# EAGLE design Robberto (EAGLE 6.5.0)
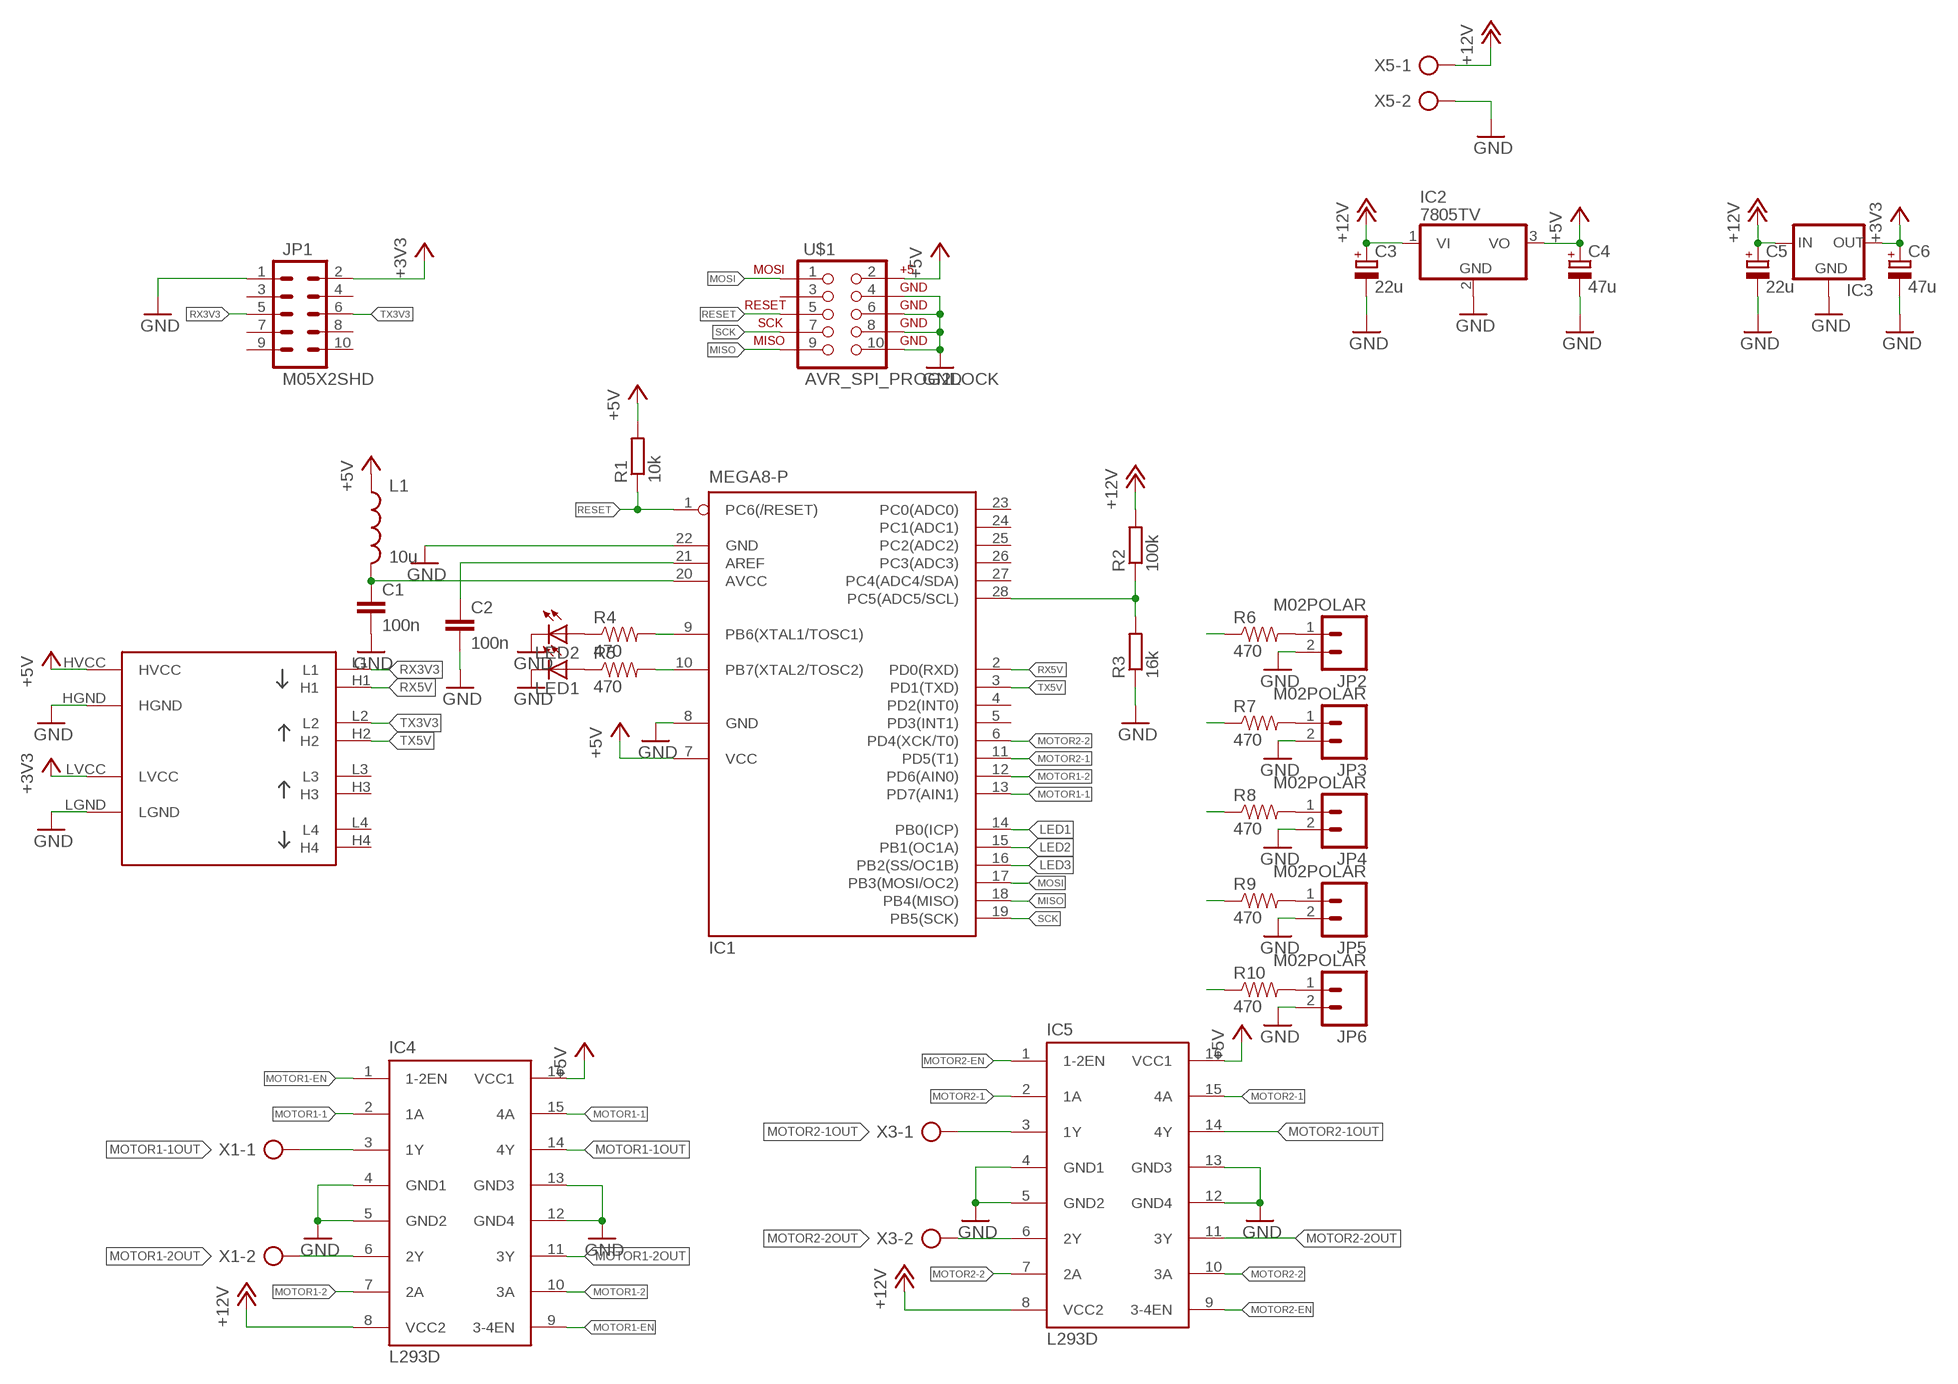
[diagram p0: schematic, sheet 1]

## Parts
C1  100n  C-EUC0805  [C0805]
C2  100n  C-EUC0805  [C0805]
C3  22u  CPOL-EUE2.5-7  [E2,5-7]
C4  47u  CPOL-EUE2.5-7  [E2,5-7]
C5  22u  CPOL-EUE2.5-7  [E2,5-7]
C6  47u  CPOL-EUE2.5-7  [E2,5-7]
IC1  MEGA8-P  [DIL28-3]
IC2  7805TV  [TO220V]
IC3  LFXXCVS  [TO220S]
IC4  L293D  [DIL16]
IC5  L293D  [DIL16]
JP1  M05X2SHD  [2X5-SHROUDED]
JP2  M02POLAR  [MOLEX-1X2]
JP3  M02POLAR  [MOLEX-1X2]
JP4  M02POLAR  [MOLEX-1X2]
JP5  M02POLAR  [MOLEX-1X2]
JP6  M02POLAR  [MOLEX-1X2]
L1  10u  INDUCTOR0805  [0805]
LED1  LEDSML0805  [SML0805]
LED2  LEDSML0805  [SML0805]
R1  10k  R-EU_M0805  [M0805]
R2  100k  R-EU_M0805  [M0805]
R3  16k  R-EU_M0805  [M0805]
R4  470  RESISTOR0805-RES  [0805]
R5  470  RESISTOR0805-RES  [0805]
R6  470  RESISTOR0805-RES  [0805]
R7  470  RESISTOR0805-RES  [0805]
R8  470  RESISTOR0805-RES  [0805]
R9  470  RESISTOR0805-RES  [0805]
R10  470  RESISTOR0805-RES  [0805]
U$1  AVR_SPI_PROG2LOCK  [2X5-SHROUDED_LOCK]
U$2  ELECTROPARK  [ELECTROPARK]
X1  AK300/2  [AK300/2]
X3  AK300/2  [AK300/2]
X5  AK300/2  [AK300/2]

## Nets
+3V3: C6.+ IC3.3(OUT) JP1.2 U$2.LVCC
+5V: C4.+ IC1.7(VCC) IC2.3(VO) IC4.16(VCC1) IC5.16(VCC1) L1.1 R1.2 U$1.2 U$2.HVCC
+12V: C3.+ C5.+ IC2.1(VI) IC3.1(IN) IC4.8(VCC2) IC5.8(VCC2) R2.2 X5.1
GND: C1.2 C2.2 C3.- C4.- C5.- C6.- IC1.8(GND) IC1.22(GND) IC2.2(GND) IC3.2(GND) IC4.4(GND1) IC4.5(GND2) IC4.12(GND4) IC4.13(GND3) IC5.4(GND1) IC5.5(GND2) IC5.12(GND4) IC5.13(GND3) JP1.1 JP2.2 JP3.2 JP4.2 JP5.2 JP6.2 LED1.C LED2.C R3.1 U$1.4 U$1.6 U$1.8 U$1.10 U$2.HGND U$2.LGND X5.2
LED1: IC1.14(PB0(ICP)) R6.1
LED2: IC1.15(PB1(OC1A)) R7.1
LED3: IC1.16(PB2(SS/OC1B)) R8.1
MISO: IC1.18(PB4(MISO)) R10.1 U$1.9
MOSI: IC1.17(PB3(MOSI/OC2)) R9.1 U$1.1
MOTOR1-1: IC1.13(PD7(AIN1)) IC4.2(1A) IC4.15(4A)
MOTOR1-1OUT: IC4.3(1Y) IC4.14(4Y) X1.1
MOTOR1-2: IC1.12(PD6(AIN0)) IC4.7(2A) IC4.10(3A)
MOTOR1-2OUT: IC4.6(2Y) IC4.11(3Y) X1.2
MOTOR1-EN: IC4.1(1-2EN) IC4.9(3-4EN)
MOTOR2-1: IC1.11(PD5(T1)) IC5.2(1A) IC5.15(4A)
MOTOR2-1OUT: IC5.3(1Y) IC5.14(4Y) X3.1
MOTOR2-2: IC1.6(PD4(XCK/T0)) IC5.7(2A) IC5.10(3A)
MOTOR2-2OUT: IC5.6(2Y) IC5.11(3Y) X3.2
MOTOR2-EN: IC5.1(1-2EN) IC5.9(3-4EN)
N$1: C1.1 IC1.20(AVCC) L1.2
N$2: C2.1 IC1.21(AREF)
N$3: IC1.28(PC5(ADC5/SCL)) R2.1 R3.2
N$4: LED2.A R4.1
N$5: LED1.A R5.1
N$6: IC1.10(PB7(XTAL2/TOSC2)) R5.2
N$7: IC1.9(PB6(XTAL1/TOSC1)) R4.2
N$8: JP2.1 R6.2
N$9: JP3.1 R7.2
N$10: JP4.1 R8.2
N$11: JP5.1 R9.2
N$12: JP6.1 R10.2
RESET: IC1.1(PC6(/RESET)) R1.1 U$1.5
RX3V3: JP1.5 U$2.L1
RX5V: IC1.2(PD0(RXD)) U$2.H1
SCK: IC1.19(PB5(SCK)) U$1.7
TX3V3: JP1.6 U$2.L2
TX5V: IC1.3(PD1(TXD)) U$2.H2
Unconnected: IC1.4(PD2(INT0)) IC1.5(PD3(INT1)) IC1.23(PC0(ADC0)) IC1.24(PC1(ADC1)) IC1.25(PC2(ADC2)) IC1.26(PC3(ADC3)) IC1.27(PC4(ADC4/SDA)) JP1.3 JP1.4 JP1.7 JP1.8 JP1.9 JP1.10 U$1.3 U$2.H3 U$2.H4 U$2.L3 U$2.L4

## Library data of the parts
C1 C2 = resistor:C-EU: CAPACITOR, European symbol
C3-C6 = resistor:CPOL-EU: POLARIZED CAPACITOR, European symbol
IC1 = atmel:MEGA8-P: MICROCONTROLLER 8 Kbytes FLASH, 1 kbytes SRAM, 512 bytes EEPROM, USART, 4-channel 10 bit ADC, 2-channel 8 bit ADC Pin compatible with Atmega48, ATMega88, ATMega168 Source: avr.lbr; OC_FARNELL: unknown; OC_NEWARK: unknown
IC2 = linear:78*: Positive VOLTAGE REGULATOR Source: http://cache.national.com/ds/LM/LM78L05.pdf http://www.fairchildsemi.com/ds/LM/LM7805.pdf
IC3 = lf33:LFXXCV: VOLTAGE REGULATOR
IC4 IC5 = st-microelectronics:L293D: PUSH-PULL 4 CHANNEL DRIVER; MPN: L293D; OC_FARNELL: 9589619; OC_NEWARK: 56P8249
JP1 = SparkFun-Connectors:M05X2: Header 5x2 Standard 10-pin dual row 0.1" header. Commonly used with AVR-ISP. Use with Spark Fun Electronics SKU: PRT-00778
JP2-JP6 = SparkFun-Connectors:M02: Standard 2-pin 0.1" header. Use with - straight break away headers ( PRT-00116) - right angle break away headers (PRT-00553) - swiss pins (PRT-00743) - machine pins (PRT-00117) - female headers (PRT-00115) Molex polarized connector foot print use with: PRT-08233 with associated crimp pins and housings. 2.54_SCREWTERM for use with PRT-10571. 3.5mm Screw Terminal footprints for PRT-08084 5mm Screw Terminal footprints for use with PRT-08433
L1 = SparkFun-Passives:INDUCTOR: Inductors Basic Inductor/Choke - 0603 and 1206. Footprints are not proven and vary greatly between part numbers. SRN6045- 33uH, 20% 1.4A SDR0403-560KL - 56uH, 10%, 500mA RMS/740mA peak
LED1 LED2 = led:LED: LED OSRAM: - CHIPLED LG R971, LG N971, LY N971, LG Q971, LY Q971, LO R971, LY R971 LH N974, LH R974 LS Q976, LO Q976, LY Q976 LO Q996 - Hyper CHIPLED LW Q18S LB Q993, LB Q99A, LB R99A - SideLED LS A670, LO A670, LY A670, LG A670, LP A670 LB A673, LV A673, LT A673, LW A673 LH A674 LY A675 LS A676, LA A676, LO A676, LY A676, LW A676 LS A679, LY A679, LG A679 - Hyper Micro SIDELED® LS Y876, LA Y876, LO Y876, LY Y876 LT Y87S - SmartLED LW L88C, LW L88S LB L89C, LB L89S, LG L890 LS L89K, LO L89K, LY L89K LS L896, LA L896, LO L896, LY L896 - TOPLED LS T670, LO T670, LY T670, LG T670, LP T670 LSG T670, LSP T670, LSY T670, LOP T670, LYG T670 LG T671, LOG T671, LSG T671 LB T673, LV T673, LT T673, LW T673 LH T674 LS T676, LA T676, LO T676, LY T676, LB T676, LH T676, LSB T676, LW T676 LB T67C, LV T67C, LT T67C, LS T67K, LO T67K, LY T67K, LW E67C LS E67B, LA E67B, LO E67B, LY E67B, LB E67C, LV E67C, LT E67C LW T67C LS T679, LY T679, LG T679 LS T770, LO T770, LY T770, LG T770, LP T770 LB T773, LV T773, LT T773, LW T773 LH T774 LS E675, LA E675, LY E675, LS T675 LS T776, LA T776, LO T776, LY T776, LB T776 LHGB T686 LT T68C, LB T68C - Hyper Mini TOPLED® LB M676 - Mini TOPLED Santana® LG M470 LS M47K, LO M47K, LY M47K Source: http://www.osram.convergy.de LUXEON: - LUMILED® LXK2-PW12-R00, LXK2-PW12-S00, LXK2-PW14-U00, LXK2-PW14-V00 LXK2-PM12-R00, LXK2-PM12-S00, LXK2-PM14-U00 LXK2-PE12-Q00, LXK2-PE12-R00, LXK2-PE12-S00, LXK2-PE14-T00, LXK2-PE14-U00 LXK2-PB12-K00, LXK2-PB12-L00, LXK2-PB12-M00, LXK2-PB14-N00, LXK2-PB14-P00, LXK2-PB14-Q00 LXK2-PR12-L00, LXK2-PR12-M00, LXK2-PR14-Q00, LXK2-PR14-R00 LXK2-PD12-Q00, LXK2-PD12-R00, LXK2-PD12-S00 LXK2-PH12-R00, LXK2-PH12-S00 LXK2-PL12-P00, LXK2-PL12-Q00, LXK2-PL12-R00 Source: www.luxeon.com KINGBRIGHT: KA-3528ASYC Source: www.kingbright.com
R1-R3 = resistor:R-EU_: RESISTOR, European symbol
R4-R10 = SparkFun-Resistors:RESISTOR: Resistor Basic schematic elements and footprints for 0603, 1206, and PTH resistors.
U$1 = SparkFun-Connectors:AVR_SPI_PROG2: AVR 10-pin ICSP Header This is the standard AVR In Circuit Serial Programming header. Minimal, but includes pin one indicator. Works with standard Olimex programmers. Also look for the 6-pin reduced version. Spark Fun Electronics SKU: PRT-00778
U$2 = konwerter_poziomow:ELECTROPARK: konwerter poziomów logicznych
X1 X3 X5 = con-ptr500:AK300/2: CONNECTOR; OC_FARNELL: unknown; OC_NEWARK: unknown

## Board
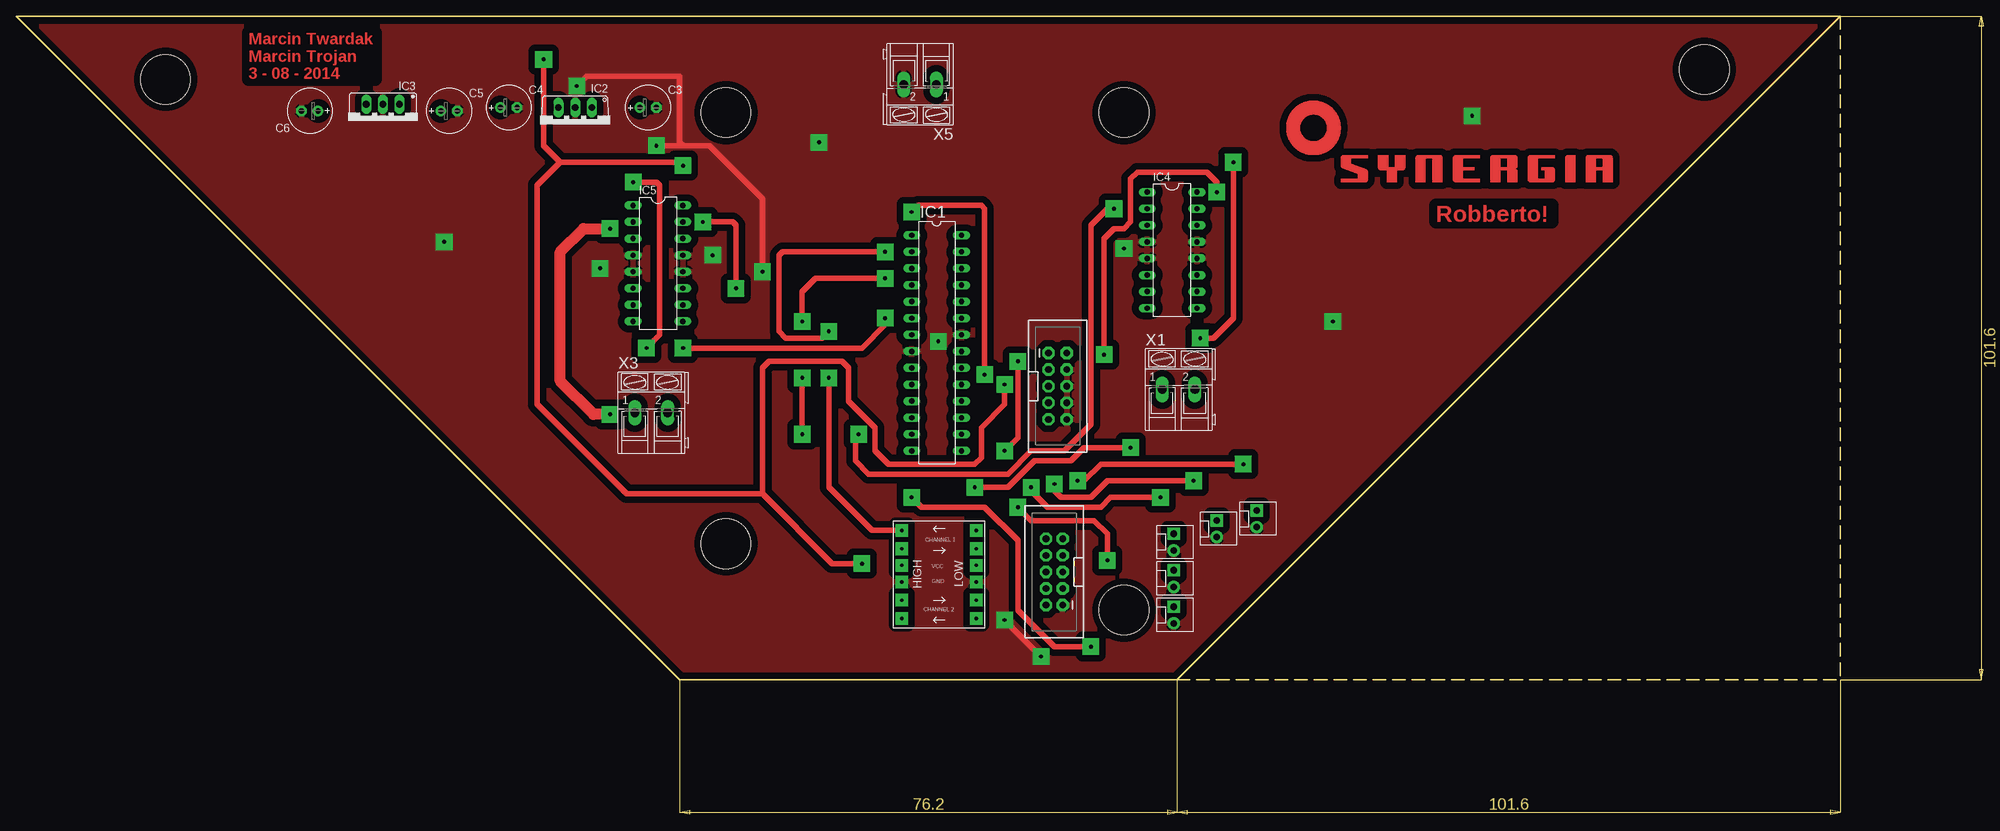
[diagram p1: board, top side]
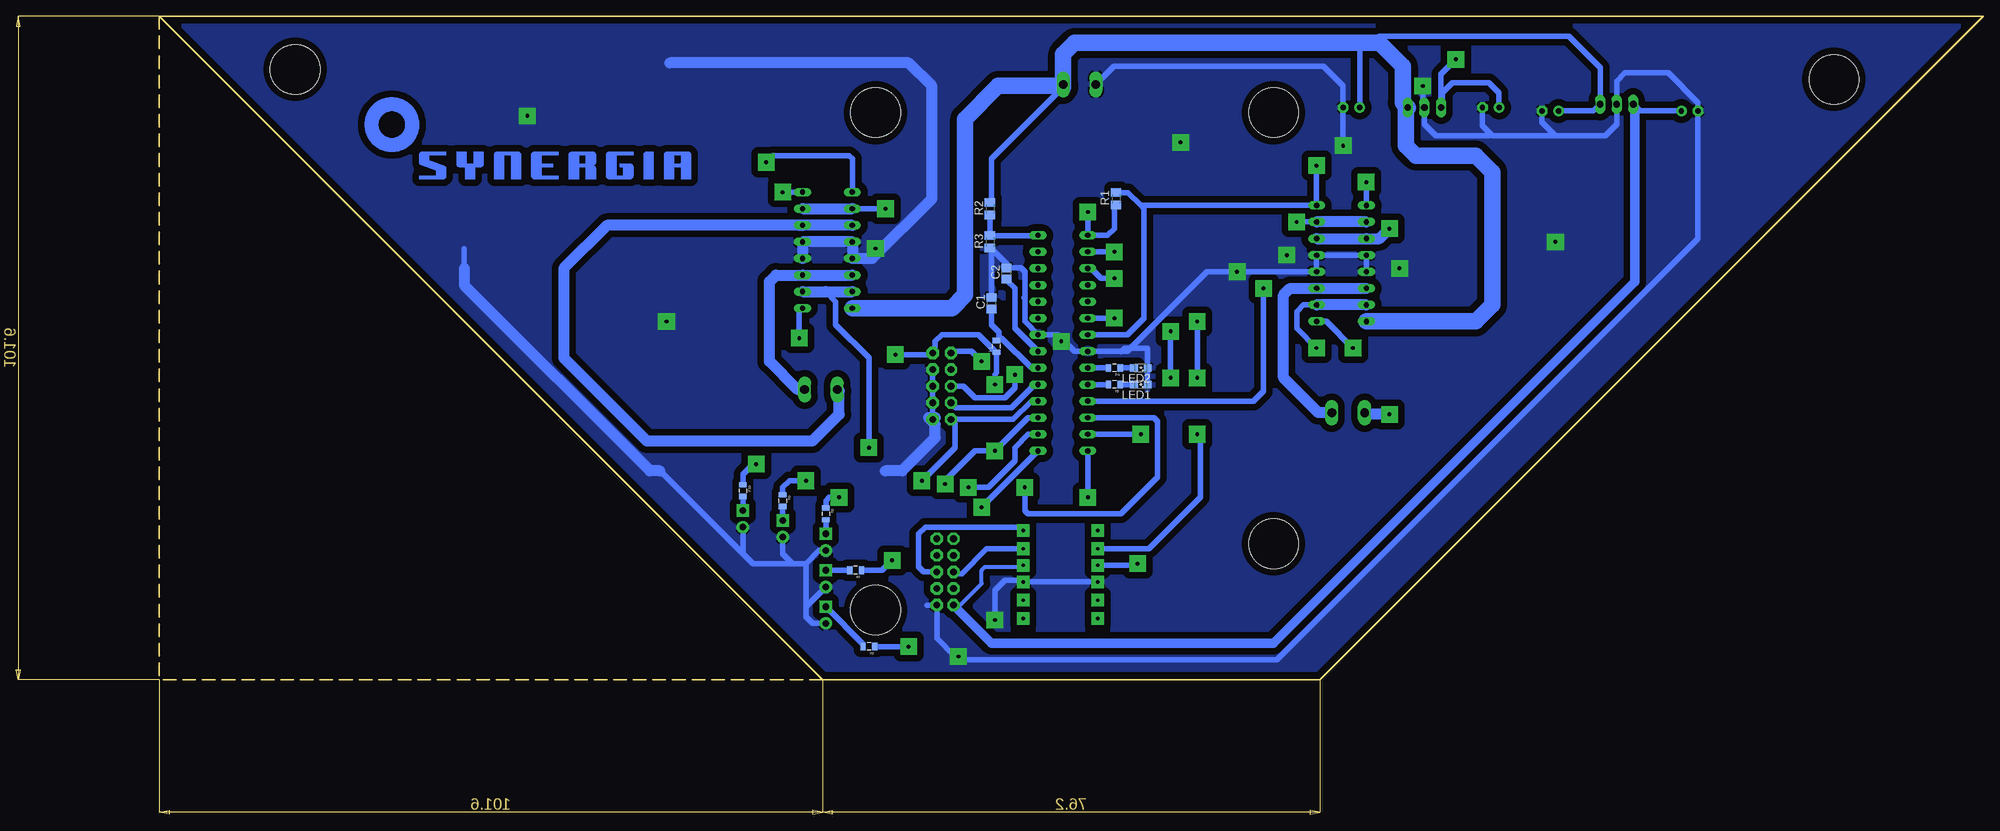
[diagram p2: board, bottom side, seen from below]

Size 279.4 x 101.6 mm. Coordinates in mm from the lower left corner, seen from the top.
Outline: 177.8,0 101.6,0 0,101.6 279.4,101.6
Outline: 177.8,0 279.4,101.6
Outline: 279.4,101.6 279.4,0 177.8,0
Copper layers (1*16): Top 0.035mm / dielectric 1.5mm / Bottom 0.035mm
Design rules "default *": minimum track width 10mil, minimum drill 2mil, track to track 8mil, track to pad 8mil, pad to pad 8mil, via to via 8mil, smd to smd 8mil, copper to edge 40mil, drill to drill 8mil, minimum pad ring 10mil, minimum via ring 8mil, stop-mask expansion 4mil, vias tented up to drill 0mil, thermal gap 10mil
Holes 7.62 mm at 169.67,10.67 108.71,20.83 169.67,86.87 108.71,86.87 258.57,93.47 22.86,91.95

### Footprints (pad centres in the part's own frame; a part is rotated, then mirrored left to right if it is on the bottom)
C0805 = smd 1.3 x 1.5: 1 -0.85,0; 2 0.85,0
E2,5-7 = drill 0.813 pad 1.6: + -1.27,0 | drill 0.813 pad 1.6 octagon: - 1.27,0
DIL28-3 = drill 0.813 long: 1 -16.51,-3.81; 2 -13.97,-3.81; 3 -11.43,-3.81; 4 -8.89,-3.81; 5 -6.35,-3.81; 6 -3.81,-3.81; 7 -1.27,-3.81; 8 1.27,-3.81; 9 3.81,-3.81; 10 6.35,-3.81; 11 8.89,-3.81; 12 11.43,-3.81; 13 13.97,-3.81; 14 16.51,-3.81; 15 16.51,3.81; 16 13.97,3.81; 17 11.43,3.81; 18 8.89,3.81; 19 6.35,3.81; 20 3.81,3.81; 21 1.27,3.81; 22 -1.27,3.81; 23 -3.81,3.81; 24 -6.35,3.81; 25 -8.89,3.81; 26 -11.43,3.81; 27 -13.97,3.81; 28 -16.51,3.81
TO220V = drill 1.016 long: 1 -2.54,-2.54; 2 0,-2.54; 3 2.54,-2.54
TO220S = drill 1.016 long: 1 -2.54,-2.54; 2 0,-2.54; 3 2.54,-2.54
DIL16 = drill 0.813 long: 1 -8.89,-3.81; 2 -6.35,-3.81; 3 -3.81,-3.81; 4 -1.27,-3.81; 5 1.27,-3.81; 6 3.81,-3.81; 7 6.35,-3.81; 8 8.89,-3.81; 9 8.89,3.81; 10 6.35,3.81; 11 3.81,3.81; 12 1.27,3.81; 13 -1.27,3.81; 14 -3.81,3.81; 15 -6.35,3.81; 16 -8.89,3.81
2X5-SHROUDED = drill 1.016 pad 1.88 octagon: 1 -1.27,5.08; 2 1.27,5.08; 3 -1.27,2.54; 4 1.27,2.54; 5 -1.27,0; 6 1.27,0; 7 -1.27,-2.54; 8 1.27,-2.54; 9 -1.27,-5.08; 10 1.27,-5.08
MOLEX-1X2 = drill 1.016 pad 1.88 square: 1 0,0 | drill 1.016 pad 1.88: 2 2.54,0
0805 = smd 0.8 x 1.2: 1 -0.9,0; 2 0.9,0
SML0805 = smd 1.2 x 1.2: A 1.05,0; C -1.05,0
M0805 = smd 1.3 x 1.6: 1 -0.95,0; 2 0.95,0
2X5-SHROUDED_LOCK = drill 1.016 pad 1.88 octagon: 1 -1.397,5.08; 2 1.397,5.08; 3 -1.397,2.54; 4 1.397,2.54; 5 -1.397,0; 6 1.397,0; 7 -1.397,-2.54; 8 1.397,-2.54; 9 -1.397,-5.08; 10 1.397,-5.08
ELECTROPARK = drill 0.5 pad 1.93 square: H1 1.27,-1.524; H2 1.27,-4.318; H3 1.27,-12.192; H4 1.27,-14.986; HGND 1.27,-9.398; HVCC 1.27,-6.858; L1 12.7,-1.524; L2 12.7,-4.318; L3 12.7,-12.192; L4 12.7,-14.986; LGND 12.7,-9.398; LVCC 12.7,-6.858
AK300/2 = drill 1.321 long: 1 -2.515,0; 2 2.489,0

### Placement (x,y rotation side)
C1  151.89,57.66 90 bottom
C2  149.61,62.23 90 bottom
C3  96.77,87.63 0 top
C4  75.44,87.63 0 top
C5  66.29,87.12 0 top
C6  44.96,87.12 180 top
IC1  140.97,51.56 270 top
IC2  85.6,85.09 180 top
IC3  56.13,85.6 180 top
IC4  177.04,65.79 270 top
IC5  98.3,63.75 270 top
JP1  159,16.51 180 top
JP2  177.29,11.18 270 top
JP3  177.29,16.76 270 top
JP4  177.29,22.35 270 top
JP5  183.9,24.38 270 top
JP6  189.99,25.91 270 top
L1  151.13,51.05 90 bottom
LED1  129.03,45.21 180 bottom
LED2  129.03,47.75 180 bottom
R1  132.84,73.66 90 bottom
R2  152.15,72.14 90 bottom
R3  152.15,67.06 90 bottom
R4  133.1,47.75 180 bottom
R5  133.1,45.21 180 bottom
R6  170.69,5.08 180 bottom
R7  172.72,16.76 180 bottom
R8  177.29,25.4 270 bottom
R9  183.9,27.43 270 bottom
R10  189.99,28.96 270 bottom
U$1  159.51,44.96 0 top
U$2  134.37,24.38 0 top
U$3  [SYNERGIA_50MM]  194.56,76.2 0 top
U$4  [SYNERGIA_50MM]  247.9,76.71 0 bottom
X1  178.05,44.45 0 top
X3  97.28,40.89 0 top
X5  138.43,91.19 180 top

### Tracks (layer width: path | path; a pad name or v marks a point on that pad's centre or on a via)
+3V3
  Bottom 0.61: JP1.2 156.72,11.43 153.42,14.73 153.42,16.76 152.91,17.27 147.32,17.27 U$2.LVCC
  Bottom 0.813: C6.+ 52.58,87.12 IC3.3
  Bottom 1.422: IC3.3 53.59,87.63 53.34,87.38 53.34,60.96 108.71,5.59 151.89,5.59 JP1.2
+5V  (via drill 0.6 pad 2.54)
  Top 0.813: v80.77,95 80.77,81.79 83.31,79.25 | 83.31,79.25 101.6,79.25 v102.11,78.74 | v129.54,17.78 124.97,17.78 114.3,28.45 | 114.3,28.45 93.47,28.45 79.76,42.16 79.76,75.69 83.31,79.25 | v151.38,45.21 151.38,42.16 147.83,38.61 147.83,34.04 146.81,33.02 133.6,33.02 131.57,35.05 131.57,38.61 127.51,42.67 127.51,47.75 126.49,48.77 115.32,48.77 114.3,47.75 114.3,28.45 | v183.9,74.68 183.9,76.2 182.37,77.72 171.7,77.72 170.69,76.71 170.69,70.1 169.67,69.09 168.15,69.09 166.62,67.56 v166.62,49.78
  Bottom 0.813: IC1.7 131.06,52.83 128.52,55.37 128.52,72.14 129.03,72.64 | IC5.16 102.62,72.64 | 102.62,72.64 129.03,72.64 | C4.+ 74.17,89.92 75.69,91.44 81.28,91.44 82.8,89.92 82.8,87.88 IC2.3 83.06,92.71 v80.77,95 | v102.11,78.74 102.11,73.15 102.62,72.64 | IC4.16 v183.9,74.68 | v166.62,49.78 161.16,49.78 U$1.2 160.53,50.42 160.53,51.82 159.51,52.83 153.92,52.83 151.25,50.15 L1.1 151.13,46.99 151.38,46.74 v151.38,45.21 | U$2.HVCC 129.79,17.53 v129.54,17.78 | R1.2 131,74.61 129.03,72.64
+12V
  Bottom 0.813: X5.1 140.94,90.7 151.89,79.76 151.89,73.34 R2.2 | C3.+ 95.5,97.03 95,97.54 | C5.+ 59.69,87.12 IC3.1 58.67,93.73 63.5,98.55 92.46,98.55 93.47,97.54
  Bottom 1.778: 88.39,87.88 IC2.1
  Bottom 2.54: IC4.8 157.99,56.9 155.96,58.93 155.96,85.85 150.88,90.93 141.2,90.93 X5.1 | 140.94,90.7 140.94,95.78 139.19,97.54 95,97.54 93.47,97.54 92.46,97.54 88.9,93.98 88.9,88.39 IC2.1 88.39,87.38 88.39,81.79 86.87,80.26 77.72,80.26 75.18,77.72 75.18,57.4 77.72,54.86 IC5.8
GND  (via drill 0.6 pad 2.54)
  Top 0.813: v85.85,90.93 87.38,92.46 101.6,92.46 101.6,82.3 102.11,81.79 | v156.97,3.56 v151.38,9.14 | v98.04,81.79 102.11,81.79 | 102.11,81.79 106.17,81.79 114.3,73.66 v114.3,62.48
  Bottom 0.813: U$1.4 U$1.6 U$1.8 U$1.10 | IC5.5 IC5.4 IC5.13 IC5.12 v114.3,62.48 118.87,62.48 131.06,50.29 132.08,50.29 | 132.08,50.29 IC1.8 139.19,50.29 141.73,52.83 IC1.22 146.81,54.86 146.81,58.42 | 65.53,83.31 57.91,83.31 56.13,85.09 IC3.2 56.13,91.69 54.86,92.96 48.26,92.96 43.69,88.39 C6.- 43.69,67.56 108.2,3.05 156.46,3.05 v156.97,3.56 157.48,3.56 160.27,6.35 JP1.1 161.8,11.43 | 65.53,83.31 67.56,85.34 C5.- | C4.- 76.71,84.84 75.44,83.57 | 75.44,83.57 75.18,83.31 65.53,83.31 | v98.04,81.79 C3.- 98.04,90.93 101.09,93.98 133.15,93.98 X5.2 | v85.85,90.93 85.85,87.88 IC2.2 85.6,85.09 83.82,83.31 75.69,83.31 75.44,83.57 | U$2.HGND U$2.LGND 147.32,15.24 149.86,15.24 151.38,13.72 v151.38,9.14 | 146.81,58.42 146.81,62.48 147.41,63.08 C2.2 149.35,63.33 149.35,63.5 151.96,66.11 R3.1 151.89,65.85 C1.2 | 146.9,58.51 146.81,58.42 | LED1.C LED2.C 127.98,48.23 128.02,48.26 128.02,50.8 131.57,50.8 132.08,50.29 | 132.05,50.26 132.08,50.29 | JP2.2 179.32,8.64 180.34,9.65 180.34,11.18 | 180.34,11.18 JP3.2 | JP4.2 178.31,19.81 180.34,17.78 | 180.34,17.78 180.34,11.18 | 180.34,17.78 182.37,17.78 | 182.37,17.78 183.9,19.3 JP5.2 | 182.37,17.78 188.47,17.78 189.99,19.3 | 189.99,19.3 202.69,32 | JP6.2 189.99,19.3 | 232.66,62.99 232.66,66.04
  Bottom 1.676: IC4.12 IC4.13 IC4.4 IC4.5 170.18,64.52 161.04,73.66 161.04,90.93 164.59,94.49 201.17,94.49 | 232.66,62.99 232.66,60.45 204.22,32 202.69,32 | 160.66,40.13 161.54,40.13 160.53,39.12 160.53,37.08 165.61,32 168.15,32 | 160.53,40.13 160.66,40.13 | 160.66,40.13 U$1.10
  other vias: 169.67,66.04 141.22,51.82 89.41,62.99 106.68,65.02 65.53,67.06 201.68,54.86 223.01,86.36 122.94,82.3
  pour Bottom (isolate 1.016): 0,101.6 279.4,101.6 177.8,0 101.6,0
  pour Top (isolate 1.016): 0,101.6 279.4,101.6 177.8,0 101.6,0
LED1  (via drill 0.6 pad 2.54)
  Top 0.813: v164.59,5.08 159,5.08 153.42,10.67 153.42,21.34 148.34,26.42 138.68,26.42 v137.16,27.94
  Bottom 0.813: v137.16,27.94 IC1.14 | v164.59,5.08 R6.1
LED2  (via drill 0.6 pad 2.54)
  Top 0.813: v153.42,26.42 155.45,24.38 165.1,24.38 167.13,22.35 v167.13,18.29
  Bottom 0.813: v153.42,26.42 IC1.15 | R7.1 168.66,16.76 v167.13,18.29
LED3  (via drill 0.6 pad 2.54)
  Top 0.813: v155.45,29.46 155.45,28.96 157.99,26.42 166.12,26.42 167.64,27.94 v175.26,27.94
  Bottom 0.813: v155.45,29.46 152.4,29.46 148.34,33.53 148.34,35.56 146.3,37.59 IC1.16 | R8.1 177.29,27.43 176.78,27.94 v175.26,27.94
MISO  (via drill 0.6 pad 2.54)
  Top 0.813: v162.56,30.48 163.58,30.48 166.12,33.02 v187.96,33.02
  Bottom 0.813: IC1.18 145.8,42.67 148.59,39.88 U$1.9 157.48,39.24 157.48,35.56 v162.56,30.48 | R10.1 189.99,31.5 188.47,33.02 v187.96,33.02
MOSI  (via drill 0.6 pad 2.54)
  Top 0.813: 151.89,35.05 v151.38,35.05 153.42,37.08 v153.42,48.77 | v159,29.97 159,28.96 160.02,27.94 164.59,27.94 167.13,30.48 v180.34,30.48
  Bottom 0.813: IC1.17 146.3,40.13 v151.38,35.05 154.43,35.05 159,30.48 v159,29.97 | U$1.1 157.86,50.29 154.94,50.29 v153.42,48.77 | R9.1 183.9,29.46 182.88,30.48 v180.34,30.48
MOTOR1-1  (via drill 0.6 pad 2.54)
  Top 0.813: v168.15,72.14 167.13,72.14 164.59,69.6 164.59,39.12 160.53,35.05 155.45,35.05 151.89,31.5 130.56,31.5 128.52,33.53 128.52,37.08 v129.03,37.59
  Bottom 0.813: IC4.2 v168.15,72.14 | v129.03,37.59 IC1.13
  Bottom 1.676: IC4.15 IC4.2
MOTOR1-1OUT
  Bottom 1.676: 181.36,69.6 IC4.14 IC4.3 210.82,69.6 217.42,62.99 217.42,49.28 204.72,36.58 179.32,36.58 175.26,40.64 175.26,44.2 175.77,44.7 175.77,44.68 X1.1
MOTOR1-2  (via drill 0.6 pad 2.54)
  Top 0.813: v170.69,35.56 163.58,35.56 161.54,33.53 155.96,33.53 151.89,29.46 v146.81,29.46
  Bottom 0.813: IC1.12 127,40.13 126.49,39.62 126.49,30.99 132.08,25.4 146.3,25.4 146.81,25.91 v146.81,29.46 | v170.69,35.56 170.69,49.28 175.77,54.36 175.77,57.91 177.29,59.44
  Bottom 1.676: IC4.10 177.29,59.44 IC4.7
MOTOR1-2OUT
  Bottom 1.676: X1.2 181.61,44.45 185.93,48.77 185.93,60.96 184.91,61.98 IC4.11 IC4.6
MOTOR1-EN  (via drill 0.6 pad 2.54)
  Top 0.813: v186.44,79.25 186.44,55.37 183.39,52.32 v181.36,52.32
  Bottom 0.813: IC4.1 173.23,79.76 173.74,80.26 185.42,80.26 v186.44,79.25 | v181.36,52.32 181.36,56.39 IC4.9
MOTOR2-1  (via drill 0.6 pad 2.54)
  Top 0.813: v110.24,59.94 110.24,69.6 109.73,70.1 v105.16,70.1
  Bottom 0.813: IC5.15 v105.16,70.1 | v110.24,59.94 110.24,44.2 111.76,42.67 IC1.11
  Bottom 1.676: IC5.2 IC5.15
MOTOR2-1OUT  (via drill 0.6 pad 2.54)
  Top 1.676: v90.93,40.64 88.39,40.64 83.31,45.72 83.31,65.53 86.87,69.09 v90.93,69.09
  Bottom 1.676: IC5.14 IC5.3 92.46,67.56 v90.93,69.09 | v90.93,40.64 94.51,40.64 X3.1
MOTOR2-2  (via drill 0.6 pad 2.54)
  Top 0.813: v102.11,50.8 129.54,50.8 133.1,54.36 v133.1,55.37
  Bottom 0.813: IC5.10 104.14,57.4 105.16,56.39 105.16,53.85 v102.11,50.8 | v133.1,55.37 IC1.6
  Bottom 1.676: IC5.7 IC5.10
MOTOR2-2OUT
  Bottom 1.676: X3.2 101.85,40.89 107.19,46.23 107.19,58.93 106.17,59.94 IC5.11 IC5.6
MOTOR2-EN  (via drill 0.6 pad 2.54)
  Top 0.813: v96.52,50.8 98.55,52.83 98.55,75.69 98.04,76.2 v94.49,76.2
  Bottom 0.813: IC5.9 100.58,54.86 v96.52,50.8 | v94.49,76.2 IC5.1
N$1
  Bottom 0.813: C1.1 151.89,54.36 150.76,53.22 150.76,52.32 | IC1.20 145.8,47.75 150.37,52.32 150.76,52.32 | 150.76,52.32 L1.2
N$2
  Bottom 0.813: C2.1 149.61,61.21 148.34,59.94 148.34,53.85 IC1.21
N$3
  Bottom 0.813: R2.1 R3.2 144.85,68.01 IC1.28
N$4
  Bottom 0.813: LED2.A R4.1
N$5
  Bottom 0.813: R5.1 LED1.A
N$6
  Bottom 0.813: R5.2 IC1.10
N$7
  Bottom 0.813: R4.2 IC1.9
N$8
  Bottom 0.813: R6.2 171.59,5.47 JP2.1
N$9
  Bottom 0.813: JP3.1 R7.2
N$10
  Bottom 0.813: JP4.1 R8.2
N$11
  Bottom 0.813: JP5.1 R9.2
N$12
  Bottom 0.813: JP6.1 R10.2
RESET  (via drill 0.6 pad 2.54)
  Top 0.813: v137.16,71.63 138.18,72.64 147.83,72.64 148.34,72.14 v148.34,46.74
  Bottom 0.813: v137.16,71.63 IC1.1 134.11,68.07 133.1,69.09 133.1,72.46 R1.1 | U$1.5 156.21,44.96 154.43,43.18 149.86,43.18 148.34,44.7 v148.34,46.74
RX3V3
  Bottom 0.813: JP1.5 162.31,16.51 163.07,17.27 163.07,22.35 162.05,23.37 147.57,23.37 U$2.L1
RX5V  (via drill 0.6 pad 2.54)
  Top 0.813: v124.46,53.34 123.44,52.32 117.86,52.32 116.84,53.34 116.84,65.02 117.35,65.53 v133.1,65.53 | v124.46,46.23 124.46,29.46 131.06,22.86 U$2.H1
  Bottom 0.813: v124.46,53.34 v124.46,46.23 | IC1.2 v133.1,65.53
SCK
  Bottom 0.813: IC1.19 145.29,45.21 148.84,41.66 157.35,41.66 U$1.7
TX3V3
  Bottom 0.813: U$2.L2 152.65,20.07 156.46,16.26 157.48,16.26 JP1.6
TX5V  (via drill 0.6 pad 2.54)
  Top 0.813: v120.4,37.59 v120.4,46.23 | v120.4,54.86 120.4,59.44 122.43,61.47 v133.1,61.47
  Bottom 0.813: U$2.H2 127.76,20.07 119.89,27.94 119.89,37.08 v120.4,37.59 | v120.4,46.23 v120.4,54.86 | IC1.3 136.65,62.99 135.13,61.47 v133.1,61.47

### Text on the board
Top: Marcin Twardak / Marcin Trojan / 3 - 08 - 2014 | Robberto!